# EAGLE design adalogger featherwing (EAGLE 7.5.0)
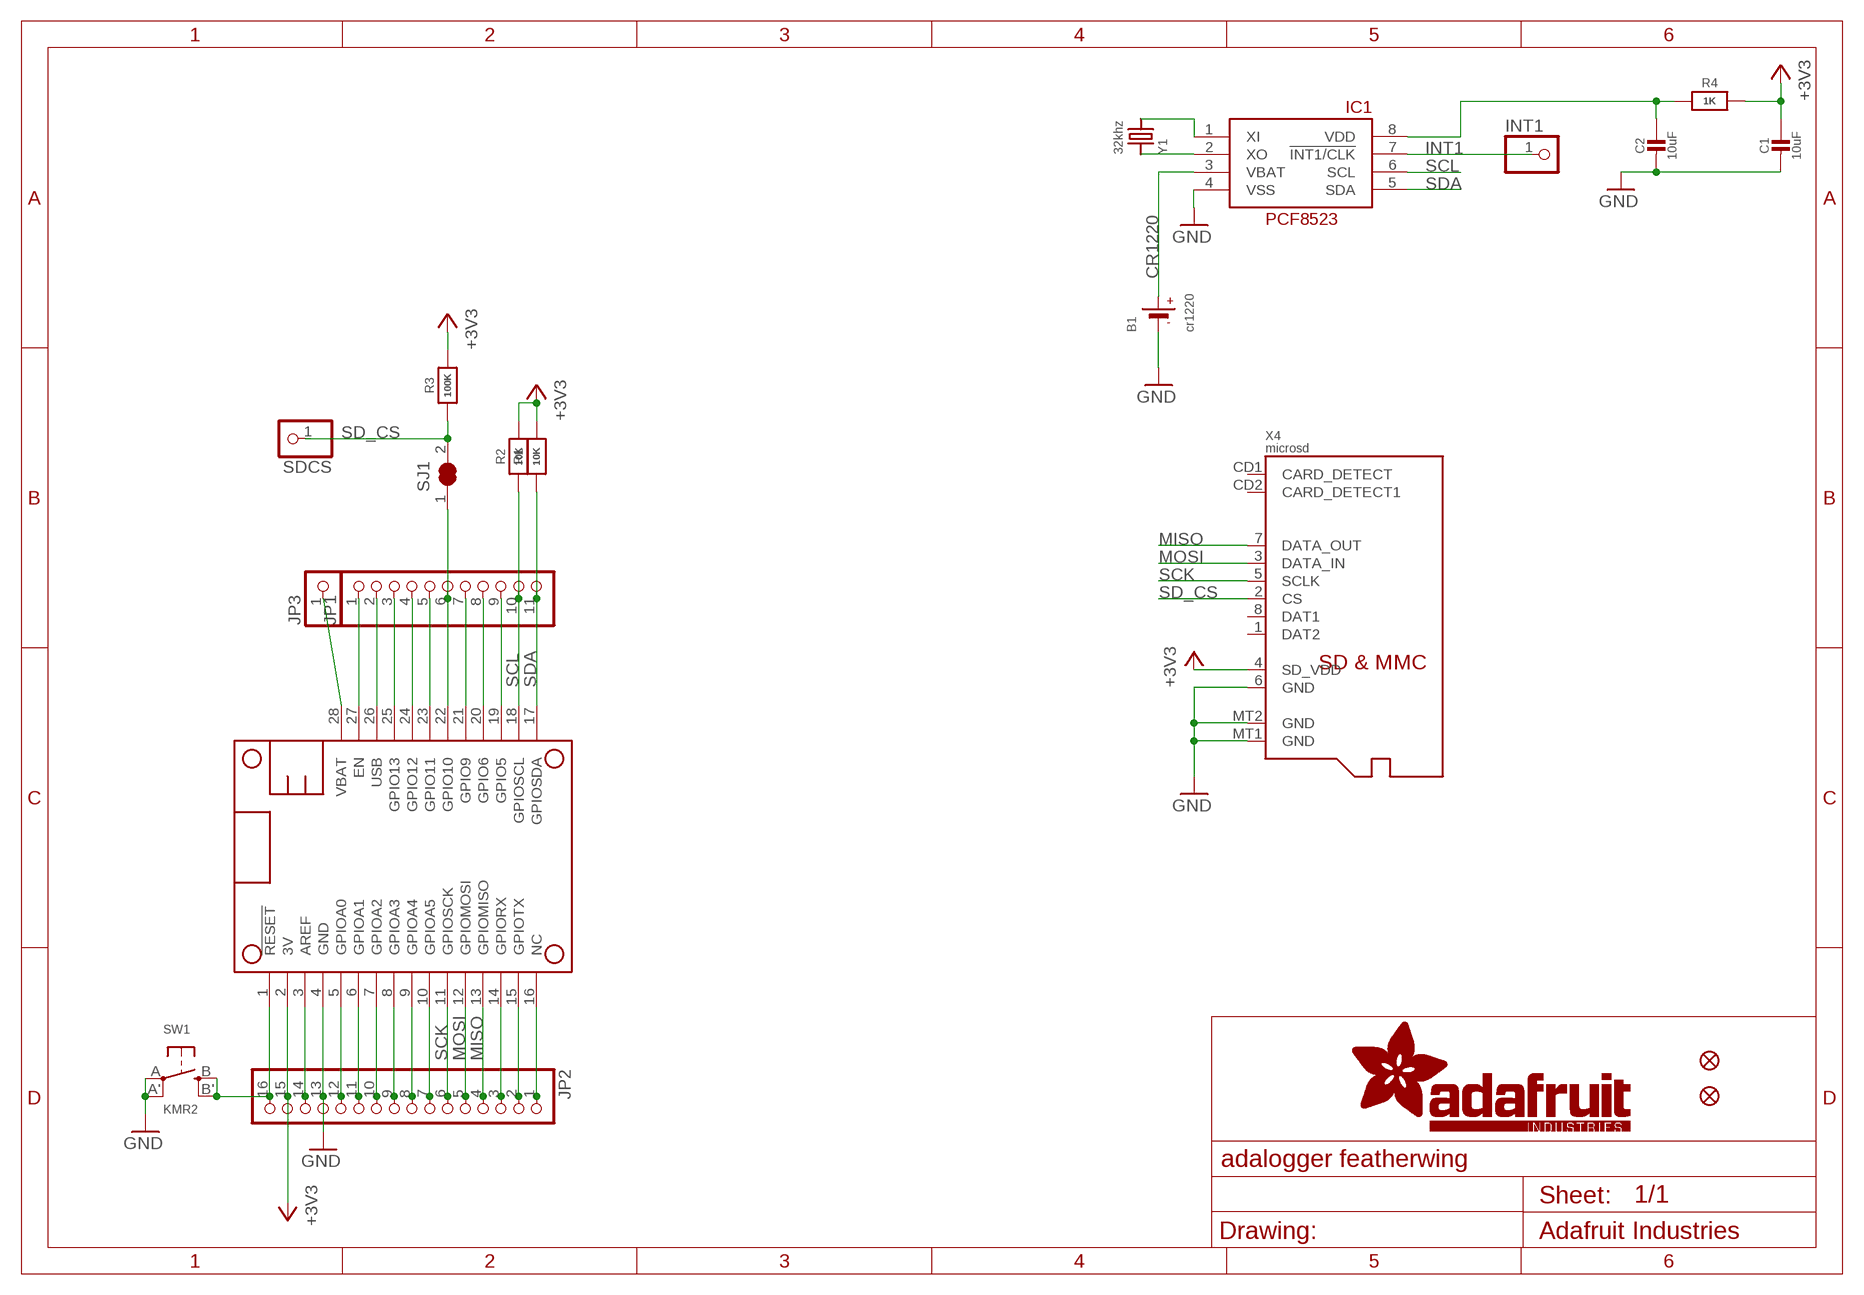
[diagram p0: schematic, sheet 1]

## Parts
B1  cr1220  BATTERYCR1220_2  [CR1220-2]
C1  10uF  CAP_CERAMIC0805-NOOUTLINE  [0805-NO]
C2  10uF  CAP_CERAMIC0805-NOOUTLINE  [0805-NO]
FID1  FIDUCIAL""  [FIDUCIAL_1MM]
FID2  FIDUCIAL""  [FIDUCIAL_1MM]
IC1  RTC_PCF8523T  [SOIC8_150MIL]
INT1  HEADER-1X1ROUND  [1X01_ROUND]
JP1  HEADER-1X11  [1X11_ROUND]
JP2  HEADER-1X16ROUND  [1X16_ROUND]
JP3  HEADER-1X1ROUND  [1X01_ROUND]
MS1  FEATHERWING_NODIM  [FEATHERWING_DIM]
R1  10K  RESISTOR0805_NOOUTLINE  [0805-NO]
R2  10K  RESISTOR0805_NOOUTLINE  [0805-NO]
R3  100K  RESISTOR0805_NOOUTLINE  [0805-NO]
R4  1K  RESISTOR0805_NOOUTLINE  [0805-NO]
SDCS  HEADER-1X1ROUND  [1X01_ROUND]
SJ1  SOLDERJUMPER_CLOSED  [SOLDERJUMPER_CLOSEDWIRE]
SW1  KMR2  SWITCH_TACT_SMT4.6X2.8  [BTN_KMR2_4.6X2.8]
X4  microsd  MICROSD  [MICROSD]
Y1  32khz  CRYSTAL8.0X3.8  [CRYSTAL_8X3.8]

## Nets
+3V3: C1.1 JP2.15 MS1.2(3V) R1.2 R2.2 R3.2 R4.1 X4.4(SD_VDD)
CR1220: B1.+ IC1.3(VBAT)
D10: JP1.6 MS1.22(GPIO10) SJ1.1
GND: B1.- C1.2 C2.2 IC1.4(VSS) JP2.13 MS1.4(GND) SW1.A'(P1) SW1.A(P) X4.6(GND) X4.MT1(GND) X4.MT2(GND)
INT1: IC1.7(!INT1/CLK) INT1.1
MISO: JP2.4 MS1.13(GPIOMISO) X4.7(DATA_OUT)
MOSI: JP2.5 MS1.12(GPIOMOSI) X4.3(DATA_IN)
N$1: JP2.16 MS1.1(!RESET) SW1.B'(S1) SW1.B(S)
N$2: JP2.1 MS1.16(NC)
N$3: JP1.3 MS1.25(GPIO13)
N$4: JP2.2 MS1.15(GPIOTX)
N$5: JP1.4 MS1.24(GPIO12)
N$6: JP2.3 MS1.14(GPIORX)
N$7: IC1.1(XI) Y1.P$4
N$8: IC1.2(XO) Y1.P$1
N$10: JP2.7 MS1.10(GPIOA5)
N$11: JP2.8 MS1.9(GPIOA4)
N$12: JP2.9 MS1.8(GPIOA3)
N$13: JP2.10 MS1.7(GPIOA2)
N$14: JP2.11 MS1.6(GPIOA1)
N$15: JP2.12 MS1.5(GPIOA0)
N$16: JP1.1 MS1.27(EN)
N$17: JP2.14 MS1.3(AREF)
N$19: JP1.5 MS1.23(GPIO11)
N$21: JP1.7 MS1.21(GPIO9)
N$22: JP1.8 MS1.20(GPIO6)
N$23: JP1.9 MS1.19(GPIO5)
PCFVDD: C2.1 IC1.8(VDD) R4.2
SCK: JP2.6 MS1.11(GPIOSCK) X4.5(SCLK)
SCL: IC1.6(SCL) JP1.10 MS1.18(GPIOSCL) R2.1
SD_CS: R3.1 SDCS.1 SJ1.2 X4.2(CS)
SDA: IC1.5(SDA) JP1.11 MS1.17(GPIOSDA) R1.1
USB: JP1.2 MS1.26(USB)
VBAT: JP3.1 MS1.28(VBAT)
Unconnected: X4.1(DAT2) X4.8(DAT1) X4.CD1(CARD_DETECT) X4.CD2(CARD_DETECT1)

## Library data of the parts
B1 = microbuilder:BATTERY: CR1220 SMT - Digikey: 3001K-ND CD2032 BAT-HLD-001 - Digikey: BAT-HLD-001-ND
C1 C2 = microbuilder:CAP_CERAMIC: Ceramic Capacitors For new designs, use the packages preceded by an '_' character since they are more reliable: The following footprints should be used on most boards: _0402 - Standard footprint for regular board layouts _0603 - Standard footprint for regular board layouts _0805 - Standard footprint for regular board layouts _1206 - Standard footprint for regular board layouts For extremely tight-pitch boards where space is at a premium, the following 'micro-pitch' footprints can be used (smaller pads, no silkscreen outline, etc.): _0402MP - Micro-pitch footprint for very dense/compact boards _0603MP - Micro-pitch footprint for very dense/compact boards _0805MP - Micro-pitch footprint for very dense/compact boards _1206MP - Micro-pitch footprint for very dense/compact boards
FID1 FID2 = microbuilder:FIDUCIAL: Fiducial Alignment Points Various fiducial points for machine vision alignment.; BOM: EXCLUDE
IC1 = microbuilder:RTC_PCF8523
INT1 JP3 SDCS = microbuilder:HEADER-1X1: PIN HEADER
JP1 = microbuilder:HEADER-1X11
JP2 = microbuilder:HEADER-1X16: PIN HEADER
MS1 = microbuilder:FEATHERWING
R1-R4 = microbuilder:RESISTOR: Resistors For new designs, use the packages preceded by an '_' character since they are more reliable: The following footprints should be used on most boards: _0402 - Standard footprint for regular board layouts _0603 - Standard footprint for regular board layouts _0805 - Standard footprint for regular board layouts _1206 - Standard footprint for regular board layouts For extremely tight-pitch boards where space is at a premium, the following 'micro-pitch' footprints can be used (smaller pads, no silkscreen outline, etc.): _0402MP - Micro-pitch footprint for very dense/compact boards _0603MP - Micro-pitch footprint for very dense/compact boards _0805MP - Micro-pitch footprint for very dense/compact boards _1206MP - Micro-pitch footprint for very dense/compact boards
SJ1 = microbuilder:SOLDERJUMPER_CLOSED: Solder Jumper - Closed These solder jumpers are closed by default CLOSEDWIRE - 10 mil trace between pads that can be cut and resoldered later CLOSEDPERM - 63 mil trace between pads for a permanent connection (used to 'bridge' two signals, a shameless hack for Eagle). Can double as a test point as well (no cream layer)
SW1 = microbuilder:SWITCH_TACT_SMT: SMT Tact Switches 6x6mm - Digikey: P12940SCT-ND KMR2 (4.6x2.8mm) - Digikey: 401-1426-1-ND EVQ-PQHB55 - Light Touch, 160GF (4.5x4.5mm) - Digikey: P8090SCT-ND KMT0 - KMT021 NGJ LHS (etc.) IP68/Waterproof - Digikey: CKN10289CT-ND
X4 = microbuilder:MICROSD: MicroSD/Transflash Card Holder with SPI pinout 3M: 2908-05WB-MG 4UConnector: 19656 Footprint courtesy: Adafruit Industries
Y1 = microbuilder:CRYSTAL: Crystals HC49UP - Surface Mount Crystal 4.0MHz 18pF +/-30ppm Surface Mount Crystal [Digikey: 535-9857-1-ND] 12.0 MHz Surface Mount Crystal [Digikey: 535-9869-6-ND] 25.0 MHz Surface Mount Crystal [Digikey: 535-9078-1-ND] 2.5 x 2.0mm - MEMs SMT Crystal 16.0 MHz 10pF 20ppm 2.5 x 2.0mm Crystal [Digikey -40-85°C: 535-10923-1-ND] 3.2 x 2.5mm - MEMs SMT Crystal 12.0 MHz 8pF 15ppm 3.2 x 2.5mm Crystal [Digikey: -10-70°C: 644-1047-1-ND -40-125°C: 644-1128-1-ND] 40~85°C cheaper: 644-1173-6-ND 16.0 MHz 8pF 15ppm 3.2 x 2.5mm Crystal [Digikey: -10-70°C: 644-1049-1-ND -40-125°C: 644-1129-2-ND]-40~85°C cheaper: 644-1175-6-ND 16.0 MHz 10pF 10ppm 3.2 x 2.5mm Crystal [Digikey: 644-1100-1-ND] 27.12 MHz 18pF 30ppm 3.2 x 2.5mm Crystal [Digikey: 887-1424-1-ND] 27.12MHz 10pF 10ppm 3.2 x 2.5mm Crystal [Digikey: 887-1329-1-ND] 4.9 x 1.8mm - MEMs SMT Crystal 32.768 KHz 12.5pF 20ppm 4.9 x 1.8mm Crystal [Digikey: SE2415CT-ND] 8.0 x 3.8mm - Surface Mount Crystal 32.768kHz 12.5pF 20ppm -40°C-85°C [Digikey: 535-9166-2-ND] Cylinder 32.768KHz Cylinder Crystal (2x6mm body) [Ex. Digikey: 300-8341-2-ND]

## Board
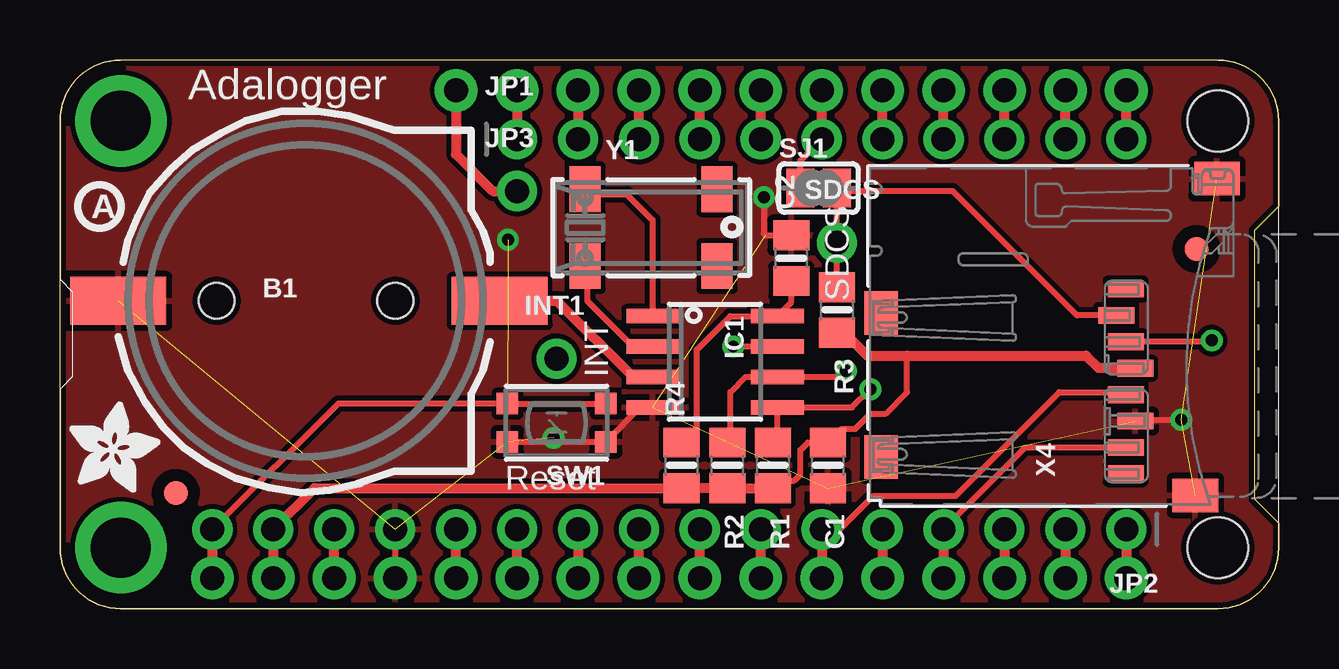
[diagram p1: board, top side]
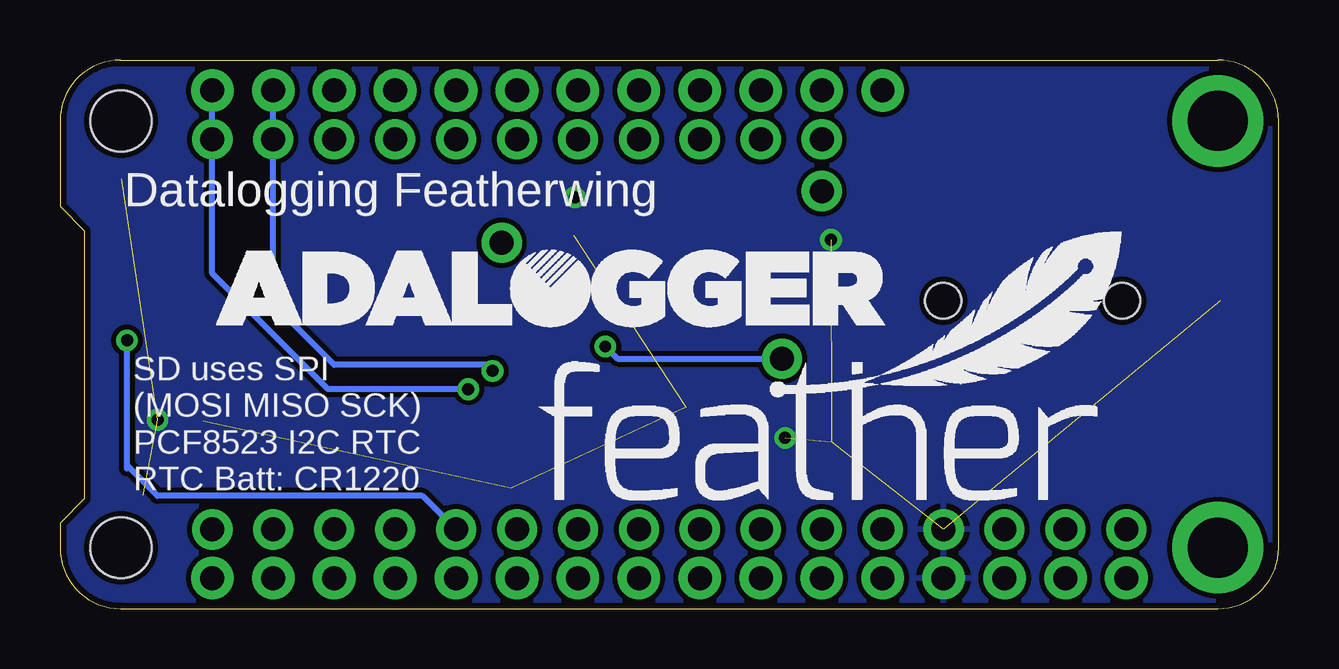
[diagram p2: board, bottom side, seen from below]

Size 50.8 x 22.86 mm. Coordinates in mm from the lower left corner, seen from the top.
Outline: 48.26,22.86 arc-90 50.8,20.32 50.8,16.76 49.78,15.75 49.78,4.57 50.8,3.56 50.8,2.54 arc-90 48.26,0 2.54,0 arc-90 0,2.54 0,20.32 arc-90 2.54,22.86 48.26,22.86
Copper layers (1*16): Top 0.035mm / dielectric 1.5mm / Bottom 0.035mm
Design rules "adafruit *": minimum track width 8mil, minimum drill 15.5mil, track to track 8mil, track to pad 8mil, pad to pad 8mil, via to via 8mil, smd to smd 8mil, copper to edge 10mil, drill to drill 8mil, minimum pad ring 10mil, minimum via ring 8mil, stop-mask expansion 2mil, vias tented up to drill 20mil, thermal gap 10mil

### Footprints (pad centres in the part's own frame; a part is rotated, then mirrored left to right if it is on the bottom)
CR1220-2 = smd 4 x 2: + 8.29,0; - -7.6,0 | hole 1.5: 3.95,0; -3.5,0
0805-NO = smd 1.24 x 1.5: 1 -0.95,0; 2 0.95,0
FIDUCIAL_1MM = smd 1 x 1: 1 0,0
SOIC8_150MIL = smd 0.6 x 2.2: 1 -1.905,-2.6; 2 -0.635,-2.6; 3 0.635,-2.6; 4 1.905,-2.6; 5 1.905,2.6; 6 0.635,2.6; 7 -0.635,2.6; 8 -1.905,2.6
1X01_ROUND = drill 1 pad 1.676: 1 0,0
1X11_ROUND = drill 1 pad 1.676: 1 -12.7,0; 2 -10.16,0; 3 -7.62,0; 4 -5.08,0; 5 -2.54,0; 6 0,0; 7 2.54,0; 8 5.08,0; 9 7.62,0; 10 10.16,0; 11 12.7,0
1X16_ROUND = drill 1 pad 1.676: 1 -19.05,0; 2 -16.51,0; 3 -13.97,0; 4 -11.43,0; 5 -8.89,0; 6 -6.35,0; 7 -3.81,0; 8 -1.27,0; 9 1.27,0; 10 3.81,0; 11 6.35,0; 12 8.89,0; 13 11.43,0; 14 13.97,0; 15 16.51,0; 16 19.05,0
FEATHERWING_DIM = drill 1 pad 1.778: 1 6.35,1.27; 2 8.89,1.27; 3 11.43,1.27; 4 13.97,1.27; 5 16.51,1.27; 6 19.05,1.27; 7 21.59,1.27; 8 24.13,1.27; 9 26.67,1.27; 10 29.21,1.27; 11 31.75,1.27; 12 34.29,1.27; 13 36.83,1.27; 14 39.37,1.27; 15 41.91,1.27; 16 44.45,1.27; 17 44.45,21.59; 18 41.91,21.59; 19 39.37,21.59; 20 36.83,21.59; 21 34.29,21.59; 22 31.75,21.59; 23 29.21,21.59; 24 26.67,21.59; 25 24.13,21.59; 26 21.59,21.59; 27 19.05,21.59; 28 16.51,21.59 | drill 2.5 pad 3.81: P$1 2.54,20.32; P$2 2.54,2.54 | hole 2.54: 48.26,20.32; 48.26,2.54
SOLDERJUMPER_CLOSEDWIRE = smd 1.168 x 1.6: 1 -0.762,0; 2 0.762,0 | smd 0.635 x 0.203: WIRE 0,0
BTN_KMR2_4.6X2.8 = smd 0.9 x 0.9: A 2.05,0.8; A' -2.05,0.8; B 2.05,-0.8; B' -2.05,-0.8
MICROSD = smd 0.7 x 1.5: 1 9,-10.64; 2 7.9,-10.24; 3 6.8,-10.64; 4 5.7,-11.04; 5 4.6,-10.64; 6 3.5,-11.04; 7 2.4,-10.64; 8 1.3,-10.64 | smd 1.8 x 1.4: CD1 2,-0.44; CD2 8,-0.44 | smd 1.4 x 1.9: MT1 0.4,-13.54; MT2 13.6,-14.44
CRYSTAL_8X3.8 = smd 1.3 x 1.9: P$1 -2.75,-1.6; P$2 2.75,-1.6; P$3 2.75,1.6; P$4 -2.75,1.6

### Placement (x,y rotation side)
B1  10.03,12.83 0 top
C1  32,5.97 270 top
C2  30.48,14.61 90 top
FID1  47.37,14.99 0 top
FID2  4.83,4.83 0 top
IC1  27.3,10.29 270 top
INT1  20.7,10.41 0 top
JP1  31.75,19.56 0 top
JP2  25.4,3.3 180 top
JP3  19.05,17.4 0 top
MS1  0,0 0 top
R1  29.72,5.97 270 top
R2  27.81,5.97 270 top
R3  32.38,12.45 270 top
R4  25.91,5.97 90 top
SDCS  32.38,15.24 0 top
SJ1  31.62,17.53 0 top
SW1  20.7,7.75 180 top
U$2  [FEATHERLOGO]  30.86,4.45 0 bottom
U$3  [ADALOGGER_LOGO]  44.32,11.68 0 bottom
U$4  [ADAFRUIT_3.5MM]  0.38,4.83 0 top
U$5  [PCBFEAT-REV-040]  1.65,16.76 0 top
X4  33.78,4.32 90 top
Y1  24.64,15.88 0 top

### Tracks (layer width: path | path; a pad name or v marks a point on that pad's centre or on a via)
+3V3
  Top 0.254: 35.31,10.54 35.31,9.02 34.42,8.13 33.78,8.13 33.15,7.49 32.58,7.49 C1.1 31.18,6.92 30.86,6.6 30.86,5.59 30.61,5.33 30.03,5.33 R1.2
  Top 0.406: X4.4 43.29,10.02 42.77,10.54 35.31,10.54 33.66,10.54 32.7,11.5 R3.2 | MS1.2 JP2.15 10.61,5.02 R4.1 R2.2 27.87,5.08 27.94,5.08 28,5.02 R1.2
CR1220
  Top 0.406: B1.+ 20.7,12.83 23.88,9.65 IC1.3
D10
  Top 0.254: SJ1.1 30.86,18.67 JP1.6
  Top 0.406: JP1.6 MS1.22
GND  (via drill 0.5)  (9 unrouted)
  Top 0.254: SW1.A SW1.A' 24.19,8.38 IC1.4 | JP2.13 MS1.4 | 30.48,15.62 C2.2 29.4,15.55 29.34,15.62 v29.34,17.14 | X4.6 44.88,7.87 v46.74,7.87
  other vias: 18.67,15.37 20.57,7.11
  pour Top: -0.25,23.11 -0.25,0 50.8,0 50.8,23.11
  pour Bottom: -0.25,23.11 -0.25,0 50.8,0 50.8,23.11
INT1  (via drill 0.48)
  Top 0.254: IC1.7 v28.07,10.92
  Bottom 0.254: v28.07,10.92 27.56,10.41 INT1.1
MISO
  Top 0.254: X4.7 40.25,6.72 JP2.4
  Top 0.406: JP2.4 MS1.13
MOSI  (via drill 0.5)
  Top 0.254: v48.01,11.18 47.95,11.12 X4.3
  Top 0.406: JP2.5 MS1.12
  Bottom 0.254: 48.01,5.84 48.01,5.97 | 48.01,5.97 v48.01,11.18 | JP2.5 35.69,4.7 46.74,4.7 48.01,5.97
N$1
  Top 0.254: SW1.B' SW1.B 11.6,8.55 JP2.16
  Top 0.406: JP2.16 MS1.1
N$2
  Top 0.406: JP2.1 MS1.16
N$3
  Top 0.406: JP1.3 MS1.25
N$4
  Top 0.406: JP2.2 MS1.15
N$5
  Top 0.406: JP1.4 MS1.24
N$6
  Top 0.406: JP2.3 MS1.14
N$7
  Top 0.254: IC1.1 24.7,14.73 24.7,14.91 24.7,16.19 23.62,17.27 22.09,17.27 Y1.P$4
N$8
  Top 0.254: Y1.P$1 21.97,14.19 21.97,12.83 23.88,10.92 IC1.2
N$10
  Top 0.406: MS1.10 JP2.7
N$11
  Top 0.406: MS1.9 JP2.8
N$12
  Top 0.406: MS1.8 JP2.9
N$13
  Top 0.406: JP2.10 MS1.7
N$14
  Top 0.406: MS1.6 JP2.11
N$15
  Top 0.406: MS1.5 JP2.12
N$16
  Top 0.406: MS1.27 JP1.1
N$17
  Top 0.406: MS1.3 JP2.14
N$19
  Top 0.406: JP1.5 MS1.23
N$21
  Top 0.406: JP1.7 MS1.21
N$22
  Top 0.406: JP1.8 MS1.20
N$23
  Top 0.406: JP1.9 MS1.19
PCFVDD
  Top 0.254: R4.2 26.54,7.55 26.54,10.79 27.94,12.19 IC1.8 30.48,12.77 C2.1
SCK
  Top 0.254: JP2.6 32.51,3.3 33.91,4.7 37.34,4.7 41.66,9.02 44.32,9.02 X4.5
  Top 0.406: JP2.6 MS1.11
SCL  (via drill 0.5)
  Top 0.254: v32.77,9.91 32.51,9.65 IC1.6 28.57,9.65 27.94,9.02 27.94,7.05 R2.1
  Top 0.406: JP1.10 MS1.18
  Bottom 0.254: v32.77,9.91 33.02,10.16 39.37,10.16 41.91,12.7 MS1.18
SD_CS
  Top 0.254: X4.2 42.39,12.22 37.21,17.4 32.51,17.4 SJ1.2 SDCS.1 R3.1
SDA  (via drill 0.5)
  Top 0.254: v33.78,9.14 33.02,8.38 IC1.5 29.91,7.11 R1.1
  Top 0.406: JP1.11 MS1.17
  Bottom 0.254: v33.78,9.14 39.62,9.14 44.45,13.97 MS1.17
USB
  Top 0.406: MS1.26 JP1.2
VBAT
  Top 0.406: MS1.28 16.51,18.92 18.03,17.4 JP3.1

### Text on the board
tPlace: Adalogger | SDCS | INT | Reset
bPlace: Datalogging Featherwing | SD uses SPI / (MOSI MISO SCK) / PCF8523 I2C RTC / RTC Batt: CR1220